# EAGLE design p214_1001_001_earth (EAGLE 6.5.0)
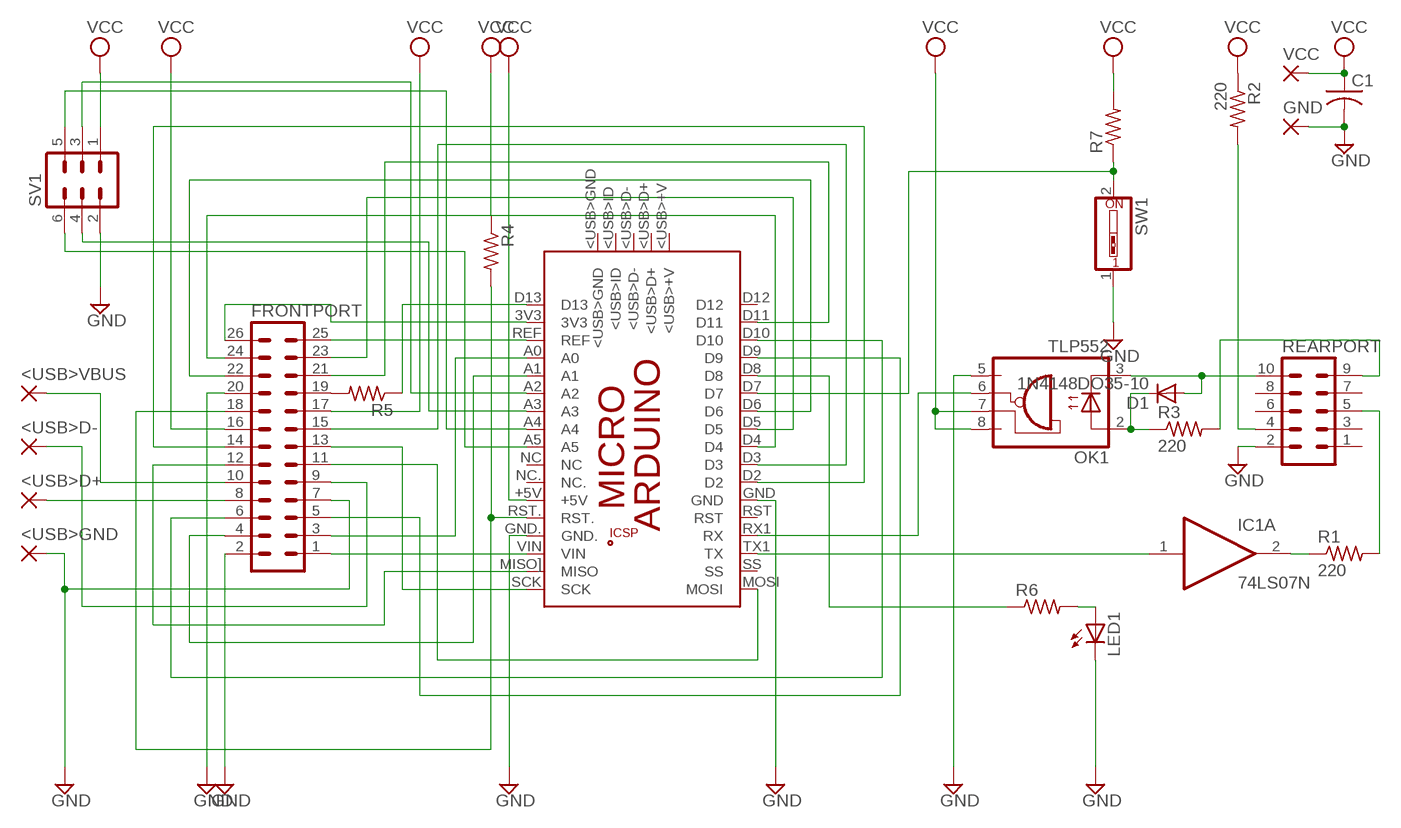
[diagram p0: schematic, sheet 1]

## Parts
<USB>D+  1,6/0,9  [1,6/0,9]
<USB>D-  1,6/0,9  [1,6/0,9]
<USB>GND  1,6/0,9  [1,6/0,9]
<USB>VBUS  1,6/0,9  [1,6/0,9]
C1  C-US025-025X050  [C025-025X050]
D1  1N4148DO35-10  [DO35-10]
FRONTPORT  ML26L  [ML26L]
GND  1,6/0,9  [1,6/0,9]
IC1  74LS07N  [DIL14]
LED1  LED3MM  [LED3MM]
OK1  TLP552  6N137  [DIL08]
PCB1  ARDUINO_MICRO  [ARDUINO_MICRO]
R1  220  R-US_0204/7  [0204/7]
R2  220  R-US_0204/7  [0204/7]
R3  220  R-US_0204/7  [0204/7]
R4  R-US_0204/7  [0204/7]
R5  R-US_0204/7  [0204/7]
R6  R-US_0204/7  [0204/7]
R7  R-US_0204/7  [0204/7]
REARPORT  ML10L  [ML10L]
SV1  MA03-2  [MA03-2]
SW1  SW_DIP-1  [EDG-01]
VCC  1,6/0,9  [1,6/0,9]

## Nets
GND: <USB>GND.1(P) C1.2 FRONTPORT.2 FRONTPORT.7 FRONTPORT.20 GND.1(P) LED1.K(C) OK1.5(GND) PCB1.GND PCB1.GND. REARPORT.2 SV1.2 SW1.1
N$1: IC1.1(A:I) PCB1.TX1(TX)
N$2: IC1.2(A:O) R1.1
N$3: D1.C OK1.2(A) R3.1
N$4: R2.2 REARPORT.4
N$5: R1.2 REARPORT.5
N$6: R3.2 REARPORT.9
N$7: D1.A OK1.3(C) REARPORT.10
N$8: OK1.6(VO) PCB1.RX1(RX)
N$9: FRONTPORT.3 PCB1.A0
N$10: FRONTPORT.1 PCB1.VIN
N$11: FRONTPORT.4 PCB1.A1
N$12: FRONTPORT.5 PCB1.D9
N$13: FRONTPORT.6 PCB1.D10
N$14: FRONTPORT.11 PCB1.MOSI
N$15: FRONTPORT.12 PCB1.MISO](MISO)
N$16: FRONTPORT.13 PCB1.SCK
N$17: FRONTPORT.14 PCB1.D2
N$18: FRONTPORT.15 PCB1.D3
N$19: FRONTPORT.19 R5.2
N$20: PCB1.D13 R5.1
N$21: FRONTPORT.25 PCB1.REF
N$22: <USB>D-.1(P) FRONTPORT.9
N$23: FRONTPORT.18 PCB1.RST. R4.2
N$24: <USB>D+.1(P) FRONTPORT.8
N$25: <USB>VBUS.1(P) FRONTPORT.10
N$26: FRONTPORT.21 PCB1.D11
N$27: FRONTPORT.22 PCB1.D6
N$28: FRONTPORT.23 PCB1.D5
N$29: FRONTPORT.24 PCB1.D4
N$30: FRONTPORT.26 PCB1.3V3
N$31: PCB1.A2 SV1.3
N$32: PCB1.A3 SV1.4
N$33: PCB1.A4 SV1.5
N$34: PCB1.A5 SV1.6
N$35: PCB1.D8 R6.1
N$36: LED1.A R6.2
N$37: PCB1.D7 R7.1 SW1.2
VCC: C1.1 FRONTPORT.16 FRONTPORT.17 OK1.7(VE) OK1.8(VCC) PCB1.+5V R2.1 R4.1 R7.2 SV1.1 VCC.1(P)
Unconnected: IC1.3(B:I) IC1.4(B:O) IC1.5(C:I) IC1.6(C:O) IC1.8(D:O) IC1.9(D:I) IC1.10(E:O) IC1.11(E:I) IC1.12(F:O) IC1.13(F:I) PCB1.5V PCB1.<USB>+V PCB1.<USB>D+ PCB1.<USB>D- PCB1.<USB>GND PCB1.<USB>ID PCB1.D12 PCB1.GND_ PCB1.MISO. PCB1.MOSI. PCB1.NC PCB1.NC. PCB1.RESET.. PCB1.RST PCB1.SCK. PCB1.SS REARPORT.1 REARPORT.3 REARPORT.6 REARPORT.7 REARPORT.8

## Power pins joined to a net without a drawn wire
GND: IC1.7(P:GND)
VCC: IC1.14(P:VCC)

## Library data of the parts
<USB>D+ <USB>D- <USB>GND <USB>VBUS GND VCC = wirepad:1,6/0,9: THROUGH-HOLE PAD
C1 = rcl:C-US: CAPACITOR, American symbol
D1 = diode:1N4148: DIODE high speed (Philips)
FRONTPORT = con-ml:ML26L: HARTING; OC_FARNELL: unknown; OC_NEWARK: unknown
IC1 = 74xx-us:74*07: Hex BUFFER, open collector high-voltage output
LED1 = led:LED: LED OSRAM: - CHIPLED LG R971, LG N971, LY N971, LG Q971, LY Q971, LO R971, LY R971 LH N974, LH R974 LS Q976, LO Q976, LY Q976 LO Q996 - Hyper CHIPLED LW Q18S LB Q993, LB Q99A, LB R99A - SideLED LS A670, LO A670, LY A670, LG A670, LP A670 LB A673, LV A673, LT A673, LW A673 LH A674 LY A675 LS A676, LA A676, LO A676, LY A676, LW A676 LS A679, LY A679, LG A679 - Hyper Micro SIDELED® LS Y876, LA Y876, LO Y876, LY Y876 LT Y87S - SmartLED LW L88C, LW L88S LB L89C, LB L89S, LG L890 LS L89K, LO L89K, LY L89K LS L896, LA L896, LO L896, LY L896 - TOPLED LS T670, LO T670, LY T670, LG T670, LP T670 LSG T670, LSP T670, LSY T670, LOP T670, LYG T670 LG T671, LOG T671, LSG T671 LB T673, LV T673, LT T673, LW T673 LH T674 LS T676, LA T676, LO T676, LY T676, LB T676, LH T676, LSB T676, LW T676 LB T67C, LV T67C, LT T67C, LS T67K, LO T67K, LY T67K, LW E67C LS E67B, LA E67B, LO E67B, LY E67B, LB E67C, LV E67C, LT E67C LW T67C LS T679, LY T679, LG T679 LS T770, LO T770, LY T770, LG T770, LP T770 LB T773, LV T773, LT T773, LW T773 LH T774 LS E675, LA E675, LY E675, LS T675 LS T776, LA T776, LO T776, LY T776, LB T776 LHGB T686 LT T68C, LB T68C - Hyper Mini TOPLED® LB M676 - Mini TOPLED Santana® LG M470 LS M47K, LO M47K, LY M47K Source: http://www.osram.convergy.de LUXEON: - LUMILED® LXK2-PW12-R00, LXK2-PW12-S00, LXK2-PW14-U00, LXK2-PW14-V00 LXK2-PM12-R00, LXK2-PM12-S00, LXK2-PM14-U00 LXK2-PE12-Q00, LXK2-PE12-R00, LXK2-PE12-S00, LXK2-PE14-T00, LXK2-PE14-U00 LXK2-PB12-K00, LXK2-PB12-L00, LXK2-PB12-M00, LXK2-PB14-N00, LXK2-PB14-P00, LXK2-PB14-Q00 LXK2-PR12-L00, LXK2-PR12-M00, LXK2-PR14-Q00, LXK2-PR14-R00 LXK2-PD12-Q00, LXK2-PD12-R00, LXK2-PD12-S00 LXK2-PH12-R00, LXK2-PH12-S00 LXK2-PL12-P00, LXK2-PL12-Q00, LXK2-PL12-R00 Source: www.luxeon.com KINGBRIGHT: KA-3528ASYC Source: www.kingbright.com
OK1 = optocoupler:6N137: MOTOROLA OPTO COUPLER; MPN: 6N137; OC_FARNELL: 1328376; OC_NEWARK: 52M1895
PCB1 = E14_Arduino:ARDUINO_MICRO: Device for representing an Arduino Micro board with a footprint in an EAGLE design. Created by Dave Young for Element14. More EAGLE documentation at: http://www.element14.com/community/community/knode/cadsoft_eagle
R1-R7 = resistor:R-US_: RESISTOR, American symbol
REARPORT = con-ml:ML10L: HARTING; OC_FARNELL: unknown; OC_NEWARK: unknown
SV1 = con-lstb:MA03-2: PIN HEADER; OC_FARNELL: unknown; OC_NEWARK: unknown
SW1 = special:SW_DIP-1: DIP SWITCH

## Board
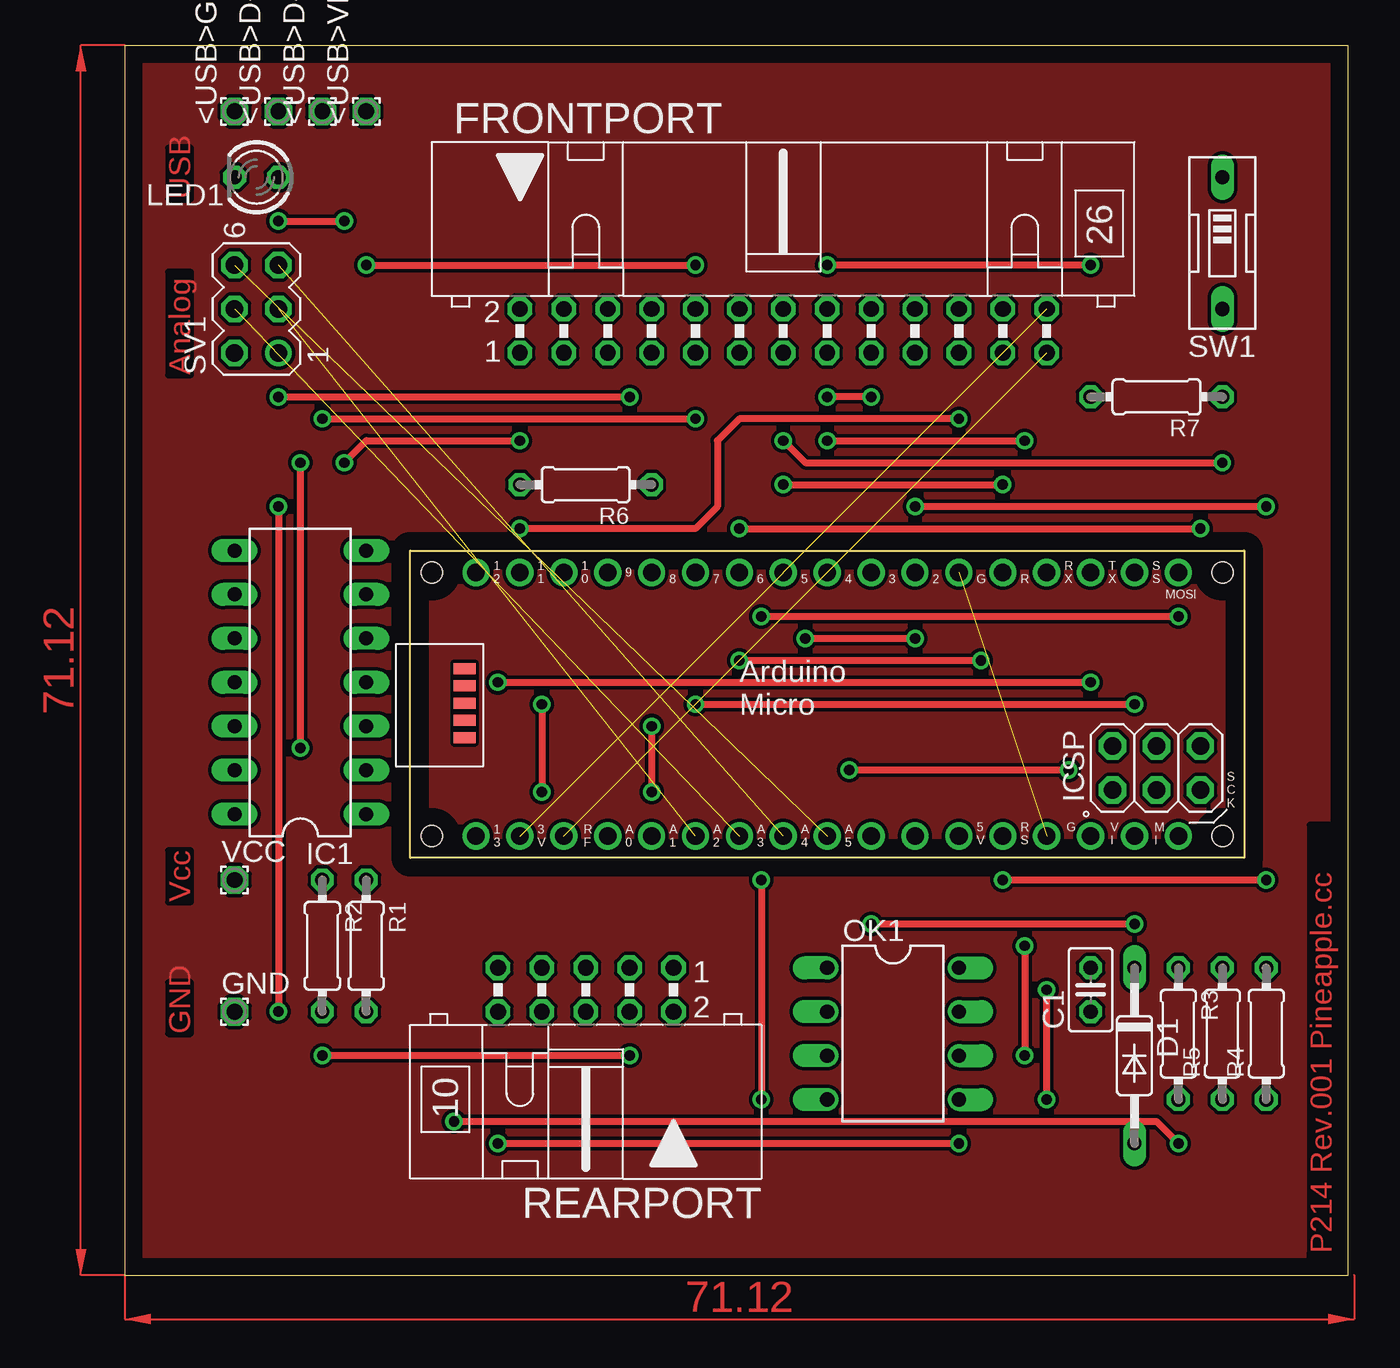
[diagram p1: board, top side]
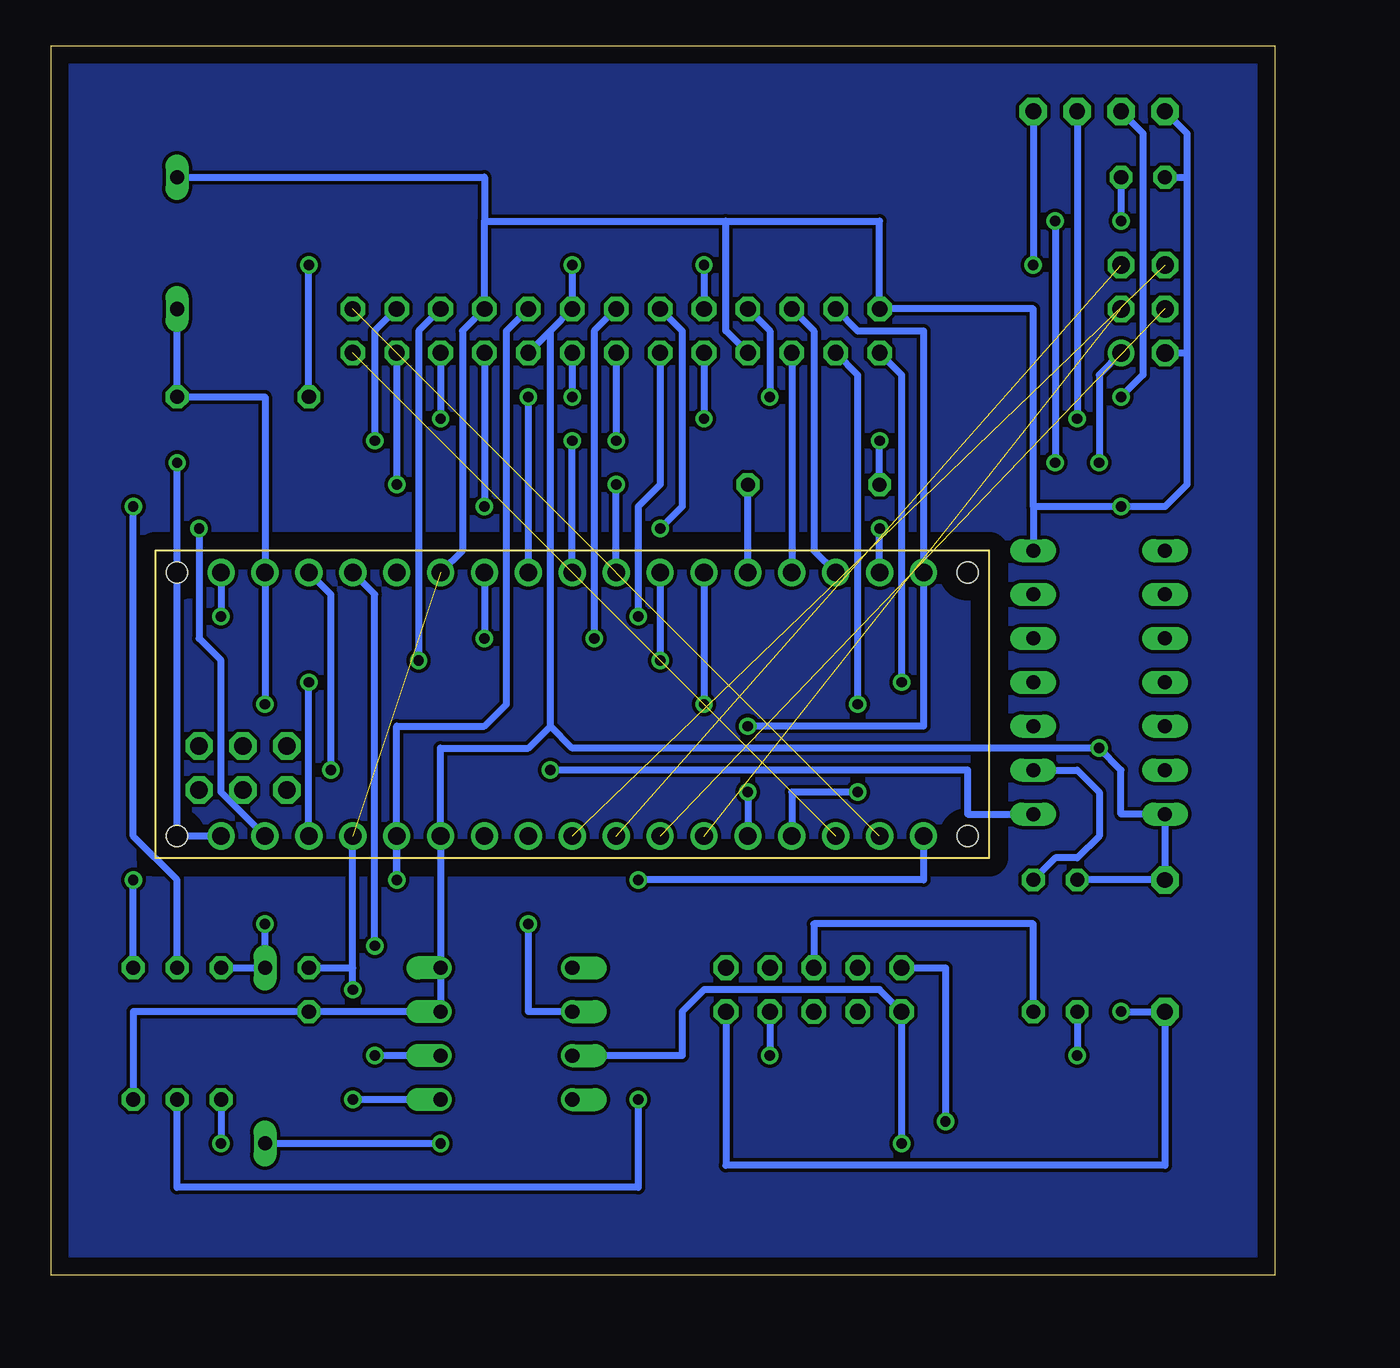
[diagram p2: board, bottom side, seen from below]

Size 70.79 x 71.11 mm. Coordinates in mm from the lower left corner, seen from the top.
Outline: 0,0 70.79,0 70.79,71.11 0,71.11 0,0
Copper layers (1*16): Top 0.035mm / dielectric 1.5mm / Bottom 0.035mm
Design rules "default": minimum track width 10mil, minimum drill 24mil, track to track 8mil, track to pad 8mil, pad to pad 8mil, via to via 8mil, smd to smd 8mil, copper to edge 40mil, drill to drill 8mil, minimum pad ring 10mil, minimum via ring 8mil, stop-mask expansion 4mil, vias tented up to drill 0mil, thermal gap 10mil

### Footprints (pad centres in the part's own frame; a part is rotated, then mirrored left to right if it is on the bottom)
1,6/0,9 = drill 0.914 pad 1.6 octagon: 1 0,0
C025-025X050 = drill 0.813 octagon: 1 -1.27,0; 2 1.27,0
DO35-10 = drill 0.813 long: A 5.08,0; C -5.08,0
ML26L = drill 0.914 octagon: 1 -15.24,-1.27; 2 -15.24,1.27; 3 -12.7,-1.27; 4 -12.7,1.27; 5 -10.16,-1.27; 6 -10.16,1.27; 7 -7.62,-1.27; 8 -7.62,1.27; 9 -5.08,-1.27; 10 -5.08,1.27; 11 -2.54,-1.27; 12 -2.54,1.27; 13 0,-1.27; 14 0,1.27; 15 2.54,-1.27; 16 2.54,1.27; 17 5.08,-1.27; 18 5.08,1.27; 19 7.62,-1.27; 20 7.62,1.27; 21 10.16,-1.27; 22 10.16,1.27; 23 12.7,-1.27; 24 12.7,1.27; 25 15.24,-1.27; 26 15.24,1.27
DIL14 = drill 0.813 long: 1 -7.62,-3.81; 2 -5.08,-3.81; 3 -2.54,-3.81; 4 0,-3.81; 5 2.54,-3.81; 6 5.08,-3.81; 7 7.62,-3.81; 8 7.62,3.81; 9 5.08,3.81; 10 2.54,3.81; 11 0,3.81; 12 -2.54,3.81; 13 -5.08,3.81; 14 -7.62,3.81
LED3MM = drill 0.813 octagon: A -1.27,0; K 1.27,0
DIL08 = drill 0.813 offset: 1 -3.81,-3.81; 2 -1.27,-3.81; 3 1.27,-3.81; 4 3.81,-3.81; 5 3.81,3.81; 6 1.27,3.81; 7 -1.27,3.81; 8 -3.81,3.81
ARDUINO_MICRO = drill 1.016 pad 1.575: 3V3 6.35,1.27; +5V 31.75,1.27; A0 11.43,1.27; A1 13.97,1.27; A2 16.51,1.27; A3 19.05,1.27; A4 21.59,1.27; A5 24.13,1.27; D2 29.21,16.51; D3 26.67,16.51; D4 24.13,16.51; D5 21.59,16.51; D6 19.05,16.51; D7 16.51,16.51; D8 13.97,16.51; D9 11.43,16.51; D10 8.89,16.51; D11 6.35,16.51; D12 3.81,16.51; D13 3.81,1.27; GND 31.75,16.51; GND. 36.83,1.27; MISO] 41.91,1.27; MOSI 44.45,16.51; NC 26.67,1.27; NC. 29.21,1.27; REF 8.89,1.27; RST 34.29,16.51; RST. 34.29,1.27; RX1 36.83,16.51; SCK 44.45,1.27; SS 41.91,16.51; TX1 39.37,16.51; VIN 39.37,1.27 | drill 1.016 pad 1.575 octagon: 5V 40.64,6.477; GND_ 45.72,6.477; MISO. 40.64,3.937; MOSI. 43.18,6.477; RESET.. 45.72,3.937; SCK. 43.18,3.937 | smd 1.27 x 0.635: <USB>+V 3.15,10.947; <USB>D+ 3.15,9.957; <USB>D- 3.15,8.941; <USB>GND 3.15,6.96; <USB>ID 3.15,7.976 | hole 1.2: 1.27,1.27; 1.27,16.51; 46.99,16.51; 46.99,1.27
0204/7 = drill 0.813 octagon: 1 -3.81,0; 2 3.81,0
ML10L = drill 0.914 octagon: 1 -5.08,-1.27; 2 -5.08,1.27; 3 -2.54,-1.27; 4 -2.54,1.27; 5 0,-1.27; 6 0,1.27; 7 2.54,-1.27; 8 2.54,1.27; 9 5.08,-1.27; 10 5.08,1.27
MA03-2 = drill 1.016: 1 -2.54,-1.27 | drill 1.016 octagon: 2 -2.54,1.27; 3 0,-1.27; 4 0,1.27; 5 2.54,-1.27; 6 2.54,1.27
EDG-01 = drill 0.813 long: 1 0,-3.81; 2 0,3.81

### Placement (x,y rotation side)
<USB>D+  8.89,67.31 90 top
<USB>D-  11.43,67.31 90 top
<USB>GND  6.35,67.31 90 top
<USB>VBUS  13.97,67.31 90 top
C1  55.88,16.51 90 top
D1  58.42,12.7 270 top
FRONTPORT  38.1,54.61 0 top
GND  6.35,15.24 0 top
IC1  10.16,34.29 90 top
LED1  7.62,63.5 180 top
OK1  44.45,13.97 270 top
PCB1  16.51,24.13 0 top
R1  13.97,19.05 270 top
R2  11.43,19.05 270 top
R3  60.96,13.97 270 top
R4  66.04,13.97 90 top
R5  63.5,13.97 90 top
R6  26.67,45.72 180 top
R7  59.69,50.8 180 top
REARPORT  26.67,16.51 180 top
SV1  7.62,55.88 90 top
SW1  63.5,59.69 180 top
VCC  6.35,22.86 0 top

### Tracks (layer width: path | path; a pad name or v marks a point on that pad's centre or on a via)
GND  (via drill 0.6)  (1 unrouted)
  Top 0.406: v53.34,10.16 v53.34,16.51 | v8.89,44.45 v8.89,15.24
  Bottom 0.406: 31.75,60.96 22.86,60.96 FRONTPORT.2 13.97,55.88 13.97,44.45 | 13.97,44.45 v8.89,44.45 6.35,44.45 5.08,45.72 5.08,53.34 | 13.97,44.45 IC1.7 | FRONTPORT.7 31.75,54.61 31.75,60.96 | PCB1.GND 46.99,41.91 46.99,54.61 FRONTPORT.20 45.72,60.96 | 45.72,60.96 31.75,60.96 | REARPORT.2 31.75,6.35 6.35,6.35 GND.1 v8.89,15.24 | v53.34,16.51 53.34,17.78 | 53.34,17.78 PCB1.GND. | OK1.5 v53.34,10.16 | C1.2 53.34,17.78 | <USB>GND.1 5.08,66.04 5.08,63.5 | 5.08,63.5 5.08,53.34 | SV1.2 5.08,53.34 | LED1.K 5.08,63.5 | SW1.1 45.72,63.5 45.72,60.96
N$1  (via drill 0.6)
  Top 0.406: v54.61,29.21 v41.91,29.21
  Bottom 0.406: v41.91,29.21 17.78,29.21 17.78,26.67 IC1.1 | v54.61,29.21 54.61,39.37 PCB1.TX1
N$2
  Bottom 0.406: IC1.2 11.43,29.21 10.16,27.94 10.16,25.4 11.43,24.13 12.7,24.13 R1.1
N$3  (via drill 0.6)
  Top 0.406: v43.18,20.32 v58.42,20.32
  Bottom 0.406: R3.1 D1.C v58.42,20.32 | OK1.2 43.18,15.24 v43.18,20.32
N$4  (via drill 0.6)
  Top 0.406: v29.21,12.7 v11.43,12.7
  Bottom 0.406: REARPORT.4 v29.21,12.7 | R2.2 v11.43,12.7
N$5
  Bottom 0.406: R1.2 13.97,20.32 26.67,20.32 REARPORT.5
N$6  (via drill 0.6)
  Top 0.406: v19.05,8.89 59.69,8.89 v60.96,7.62
  Bottom 0.406: R3.2 v60.96,7.62 | REARPORT.9 19.05,17.78 v19.05,8.89
N$7  (via drill 0.6)
  Top 0.406: v21.59,7.62 v48.26,7.62
  Bottom 0.406: D1.A v48.26,7.62 | v21.59,7.62 REARPORT.10 22.86,16.51 33.02,16.51 34.29,15.24 34.29,12.7 OK1.3
N$8  (via drill 0.6)
  Top 0.406: v52.07,19.05 v52.07,12.7
  Bottom 0.406: OK1.6 v52.07,12.7 | v52.07,19.05 52.07,39.37 PCB1.RX1
N$9  (via drill 0.6)
  Top 0.406: v24.13,33.02 v24.13,27.94
  Bottom 0.406: v24.13,27.94 27.94,27.94 PCB1.A0 | FRONTPORT.3 24.13,52.07 v24.13,33.02
N$10  (via drill 0.6)
  Top 0.406: v21.59,34.29 v55.88,34.29
  Bottom 0.406: PCB1.VIN v55.88,34.29 | FRONTPORT.1 21.59,52.07 v21.59,34.29
N$11  (via drill 0.6)
  Top 0.406: v30.48,31.75 v30.48,27.94
  Bottom 0.406: v30.48,31.75 20.32,31.75 20.32,54.61 24.13,54.61 FRONTPORT.4 | v30.48,27.94 PCB1.A1
N$12
  Bottom 0.406: FRONTPORT.5 PCB1.D9
N$13
  Bottom 0.406: FRONTPORT.6 26.67,54.61 26.67,41.91 PCB1.D10
N$14  (via drill 0.6)
  Top 0.406: v36.83,38.1 v60.96,38.1
  Bottom 0.406: PCB1.MOSI v60.96,38.1 | FRONTPORT.11 35.56,45.72 36.83,44.45 v36.83,38.1
N$15  (via drill 0.6)
  Top 0.406: v35.56,43.18 v62.23,43.18
  Bottom 0.406: v62.23,43.18 62.23,36.83 60.96,35.56 60.96,27.94 PCB1.MISO] | FRONTPORT.12 34.29,54.61 34.29,44.45 v35.56,43.18
N$16  (via drill 0.6)
  Top 0.406: v38.1,48.26 39.37,46.99 v63.5,46.99
  Bottom 0.406: PCB1.SCK 63.5,25.4 v63.5,46.99 | FRONTPORT.13 v38.1,48.26
N$17  (via drill 0.6)
  Top 0.406: v39.37,36.83 v45.72,36.83
  Bottom 0.406: PCB1.D2 v45.72,36.83 | FRONTPORT.14 39.37,54.61 v39.37,36.83
N$18  (via drill 0.6)
  Top 0.406: v43.18,50.8 v40.64,50.8
  Bottom 0.406: FRONTPORT.15 v40.64,50.8 | PCB1.D3 v43.18,50.8
N$19  (via drill 0.6)
  Top 0.406: v66.04,44.45 v45.72,44.45
  Bottom 0.406: FRONTPORT.19 v45.72,44.45 | v66.04,44.45 66.04,25.4 63.5,22.86 R5.2
N$20  (via drill 0.6)
  Top 0.406: v36.83,22.86 v36.83,10.16
  Bottom 0.406: PCB1.D13 20.32,22.86 v36.83,22.86 | v36.83,10.16 36.83,5.08 63.5,5.08 R5.1
N$21  (1 unrouted)
N$22  (via drill 0.6)
  Top 0.406: v11.43,49.53 v33.02,49.53
  Bottom 0.406: <USB>D-.1 v11.43,49.53 | FRONTPORT.9 v33.02,49.53
N$23  (via drill 0.6)
  Top 0.406: v50.8,22.86 v66.04,22.86
  Bottom 0.406: R4.2 v66.04,22.86 | PCB1.RST. v50.8,22.86 50.8,31.75 45.72,31.75 44.45,33.02 44.45,54.61 FRONTPORT.18
N$24  (via drill 0.6)
  Top 0.406: v8.89,50.8 v29.21,50.8
  Bottom 0.406: FRONTPORT.8 29.21,54.61 v29.21,50.8 | <USB>D+.1 7.62,66.04 7.62,52.07 v8.89,50.8
N$25  (via drill 0.6)
  Top 0.406: v13.97,58.42 v33.02,58.42
  Bottom 0.406: v33.02,58.42 FRONTPORT.10 | <USB>VBUS.1 v13.97,58.42
N$26  (via drill 0.6)
  Top 0.406: v48.26,49.53 35.56,49.53 34.29,48.26 34.29,44.45 33.02,43.18 v22.86,43.18
  Bottom 0.406: PCB1.D11 v22.86,43.18 | FRONTPORT.21 v48.26,49.53
N$27  (via drill 0.6)
  Top 0.406: v35.56,35.56 v49.53,35.56
  Bottom 0.406: PCB1.D6 v35.56,35.56 | FRONTPORT.22 49.53,54.61 v49.53,35.56
N$28  (via drill 0.6)
  Top 0.406: v38.1,45.72 v50.8,45.72
  Bottom 0.406: FRONTPORT.23 v50.8,45.72 | PCB1.D5 v38.1,45.72
N$29  (via drill 0.6)
  Top 0.406: v40.64,48.26 v52.07,48.26
  Bottom 0.406: PCB1.D4 v40.64,48.26 | FRONTPORT.24 52.07,54.61 v52.07,48.26
N$30  (1 unrouted)
N$31  (1 unrouted)
N$32  (1 unrouted)
N$33  (1 unrouted)
N$34  (1 unrouted)
N$35
  Bottom 0.406: PCB1.D8 R6.1
N$36  (via drill 0.6)
  Top 0.406: v8.89,60.96 v12.7,60.96 | v12.7,46.99 13.97,48.26 v22.86,48.26
  Bottom 0.406: LED1.A v8.89,60.96 | R6.2 v22.86,48.26 | v12.7,60.96 v12.7,46.99
N$37  (via drill 0.6)
  Top 0.406: v33.02,33.02 v58.42,33.02
  Bottom 0.406: SW1.2 R7.1 58.42,50.8 v58.42,33.02 | PCB1.D7 v33.02,33.02
N$38
  pour Bottom: 0,71.12 71.12,71.12 71.12,0 0,0
N$39
  pour Top: 0,71.12 71.12,71.12 71.12,0 0,0
VCC  (via drill 0.6)
  Top 0.406: v10.16,46.99 v10.16,30.48 | v55.88,58.42 v40.64,58.42
  Bottom 0.406: R2.1 VCC.1 IC1.14 8.89,26.67 8.89,29.21 v10.16,30.48 40.64,30.48 41.91,31.75 | R4.1 66.04,15.24 C1.1 OK1.7 OK1.8 PCB1.+5V 48.26,30.48 43.18,30.48 41.91,31.75 | 41.91,31.75 41.91,54.61 | 41.91,54.61 FRONTPORT.16 v40.64,58.42 | 41.91,54.61 FRONTPORT.17 | SV1.1 10.16,52.07 v10.16,46.99 | R7.2 v55.88,58.42
(copper drawn outside any net)
  shapes: Top area x2

### Text on the board
Top: USB | Analog | Vcc | GND | P214 Rev.001 Pineapple.cc